# EAGLE schematic LAMPS - Copy (EAGLE 6.3)
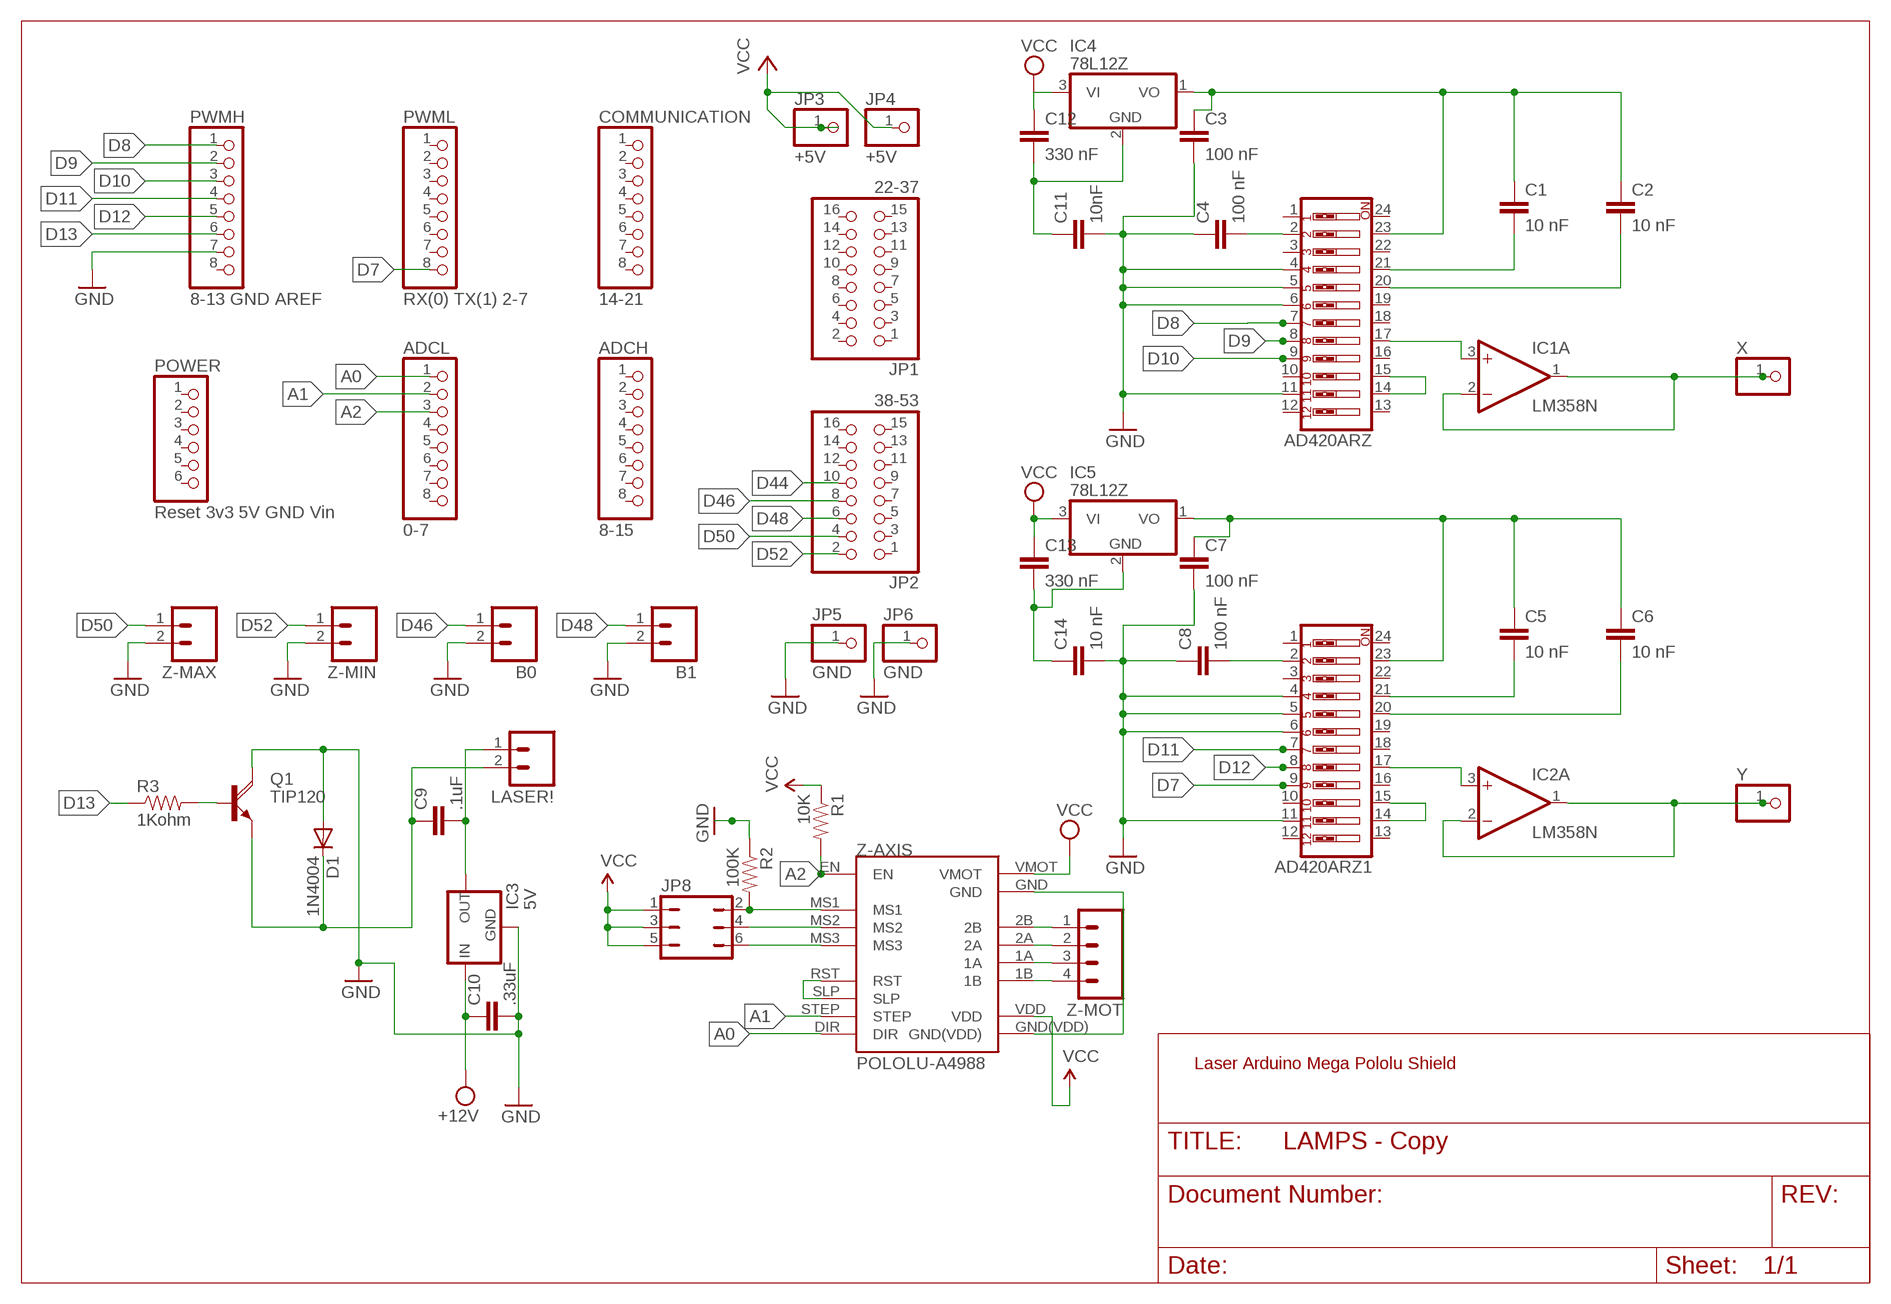
[diagram p0: schematic, sheet 1]

## Parts
AD420ARZ  SW_DIP-12  [EDG-12]
AD420ARZ1  SW_DIP-12  [EDG-12]
ADCH  8-15  PINHD-1X8  [1X08]
ADCL  0-7  PINHD-1X8  [1X08]
B0  M02PTH  [1X02]
B1  M02PTH  [1X02]
C1  10 nF  C2,5-3  [C2.5-3]
C2  10 nF  C2,5-3  [C2.5-3]
C3  100 nF  C2,5-3  [C2.5-3]
C4  100 nF  C2,5-3  [C2.5-3]
C5  10 nF  C2,5-3  [C2.5-3]
C6  10 nF  C2,5-3  [C2.5-3]
C7  100 nF  C2,5-3  [C2.5-3]
C8  100 nF  C2,5-3  [C2.5-3]
C9  .1uF  CAPPTH  [CAP-PTH-SMALL]
C10  .33uF  CAPPTH  [CAP-PTH-SMALL]
C11  10nF  C2,5-3  [C2.5-3]
C12  330 nF  C2,5-3  [C2.5-3]
C13  330 nF  C2,5-3  [C2.5-3]
C14  10 nF  C2,5-3  [C2.5-3]
COMMUNICATION  14-21  PINHD-1X8  [1X08]
D1  1N4004  [DO41-10]
IC1  LM358N  [DIL08]
IC2  LM358N  [DIL08]
IC3  5V  V_REG_78XXSIDE  [78XXL]
IC4  78L12Z  [TO92]
IC5  78L12Z  [TO92]
JP1  22-37  PINHD-2X8  [2X08]
JP2  38-53  PINHD-2X8  [2X08]
JP3  +5V  PINHD-1X1  [1X01]
JP4  +5V  PINHD-1X1  [1X01]
JP5  GND  PINHD-1X1  [1X01]
JP6  GND  PINHD-1X1  [1X01]
JP8  JP3Q  [JP3Q]
LASER!  M02POLAR  [MOLEX-1X2]
POWER  Reset 3v3 5V GND Vin  PINHD-1X6  [1X06]
PWMH  8-13 GND AREF  PINHD-1X8  [1X08]
PWML  RX(0) TX(1) 2-7  PINHD-1X8  [1X08]
Q1  TIP120  [TO220AH]
R1  10K  RESISTORAXIAL-0.3  [AXIAL-0.3]
R2  100K  RESISTORAXIAL-0.3  [AXIAL-0.3]
R3  1Kohm  RESISTORAXIAL-0.3  [AXIAL-0.3]
X  PINHD-1X1  [1X01]
Y  PINHD-1X1  [1X01]
Z-AXIS  POLOLU-A4988  [DIL_A4988]
Z-MAX  M02PTH  [1X02]
Z-MIN  M02PTH  [1X02]
Z-MOT  M04POLAR  [MOLEX-1X4]

## Nets
A0: ADCL.1 Z-AXIS.DIR
A1: ADCL.2 Z-AXIS.STEP
A2: ADCL.3 R1.P$2 Z-AXIS.EN
D7: AD420ARZ1.9 PWML.8
D8: AD420ARZ.7 PWMH.1
D9: AD420ARZ.8 PWMH.2
D10: AD420ARZ.9 PWMH.3
D11: AD420ARZ1.7 PWMH.4
D12: AD420ARZ1.8 PWMH.5
D13: PWMH.6 R3.P$1
D44: JP2.10 Q1.B R3.P$2
D46: B0.1 JP2.8
D48: B1.1 JP2.6
D50: JP2.4 Z-MAX.1
D52: JP2.2 Z-MIN.1
GND: AD420ARZ1.4 AD420ARZ1.5 AD420ARZ1.6 AD420ARZ1.11 AD420ARZ.4 AD420ARZ.5 AD420ARZ.6 AD420ARZ.11 B0.2 B1.2 C3.2 C4.1 C7.2 C8.1 C10.2 C11.1 C11.2 C12.2 C14.2 D1.A IC3.GND IC4.2(GND) JP5.1 JP6.1 PWMH.7 Q1.C R2.P$1 Z-MAX.2 Z-MIN.2
N$1: AD420ARZ1.21 C5.2
N$2: AD420ARZ1.20 C6.2
N$3: AD420ARZ.21 C1.2
N$4: AD420ARZ.20 C2.2
N$5: AD420ARZ.17 IC1.3(A:+IN)
N$6: AD420ARZ.14 AD420ARZ.15
N$7: IC1.1(A:OUT) IC1.2(A:-IN) X.1
N$8: AD420ARZ1.17 IC2.3(A:+IN)
N$9: AD420ARZ1.14 AD420ARZ1.15
N$10: IC2.1(A:OUT) IC2.2(A:-IN) Y.1
N$11: Z-AXIS.RST Z-AXIS.SLP
N$12: C9.2 IC3.OUT LASER!.1
N$13: C9.1 D1.C LASER!.2 Q1.E
N$14: Z-AXIS.GND Z-AXIS.GND(VDD)
N$15: JP8.2 R2.P$2 Z-AXIS.MS1
N$16: JP8.4 Z-AXIS.MS2
N$17: JP8.6 Z-AXIS.MS3
N$18: AD420ARZ.23 C1.1 C2.1 C3.1 IC4.1(VO)
N$19: AD420ARZ.2 C4.2
N$20: Z-AXIS.2B Z-MOT.1
N$21: Z-AXIS.2A Z-MOT.2
N$22: Z-AXIS.1A Z-MOT.3
N$23: Z-AXIS.1B Z-MOT.4
N$24: AD420ARZ1.2 C8.2
N$25: AD420ARZ1.23 C5.1 C6.1 C7.1 IC5.1(VO)
N$26: C13.2 C14.1 IC5.2(GND)
VCC: C10.1 C12.1 C13.1 IC3.IN IC4.3(VI) IC5.3(VI) JP3.1 JP4.1 JP8.1 JP8.3 JP8.5 R1.P$1 Z-AXIS.VDD Z-AXIS.VMOT ; supply symbol labelled +12V
Unconnected: AD420ARZ1.1 AD420ARZ1.3 AD420ARZ1.10 AD420ARZ1.12 AD420ARZ1.13 AD420ARZ1.16 AD420ARZ1.18 AD420ARZ1.19 AD420ARZ1.22 AD420ARZ1.24 AD420ARZ.1 AD420ARZ.3 AD420ARZ.10 AD420ARZ.12 AD420ARZ.13 AD420ARZ.16 AD420ARZ.18 AD420ARZ.19 AD420ARZ.22 AD420ARZ.24 ADCH.1 ADCH.2 ADCH.3 ADCH.4 ADCH.5 ADCH.6 ADCH.7 ADCH.8 ADCL.4 ADCL.5 ADCL.6 ADCL.7 ADCL.8 COMMUNICATION.1 COMMUNICATION.2 COMMUNICATION.3 COMMUNICATION.4 COMMUNICATION.5 COMMUNICATION.6 COMMUNICATION.7 COMMUNICATION.8 IC1.5(B:+IN) IC1.6(B:-IN) IC1.7(B:OUT) IC2.5(B:+IN) IC2.6(B:-IN) IC2.7(B:OUT) JP1.1 JP1.2 JP1.3 JP1.4 JP1.5 JP1.6 JP1.7 JP1.8 JP1.9 JP1.10 JP1.11 JP1.12 JP1.13 JP1.14 JP1.15 JP1.16 JP2.1 JP2.3 JP2.5 JP2.7 JP2.9 JP2.11 JP2.12 JP2.13 JP2.14 JP2.15 JP2.16 POWER.1 POWER.2 POWER.3 POWER.4 POWER.5 POWER.6 PWMH.8 PWML.1 PWML.2 PWML.3 PWML.4 PWML.5 PWML.6 PWML.7

## Notes on the sheet
- Laser Arduino Mega Pololu Shield

## Power pins joined to a net without a drawn wire
V+: IC1.8(P:V+) IC2.8(P:V+)
V-: IC1.4(P:V-) IC2.4(P:V-)

## Library data of the parts
AD420ARZ AD420ARZ1 = special:SW_DIP-12: DIP SWITCH
ADCH ADCL COMMUNICATION PWMH PWML = pinhead:PINHD-1X8: PIN HEADER
B0 B1 LASER! Z-MAX Z-MIN = SparkFun:M02: Header 2 Standard 2-pin 0.1" header. Use with straight break away headers (SKU : PRT-00116), right angle break away headers (PRT-00553), swiss pins (PRT-00743), machine pins (PRT-00117), and female headers (PRT-00115). Molex polarized connector foot print use with SKU : PRT-08233 with associated crimp pins and housings.
C1-C8 C11-C14 = capacitor-wima:C: CAPACITOR naming: grid - package width
C9 C10 = SparkFun:CAP: Capacitor Standard 0603 ceramic capacitor, and 0.1" leaded capacitor.
D1 = diode:1N4004: DIODE general purpose rectifier, 1 A
IC1 IC2 = linear:LM358: OP AMP also LM158; LM258; LM2904 Source: http://cache.national.com/ds/LM/LM158.pdf
IC3 = SparkFun:V_REG_78XX: Voltage Regulator Standard 7805 5V regulator. IGO (Input Ground Output). Spark Fun Electronics SKU : COM-00107
IC4 IC5 = linear:78*: Positive VOLTAGE REGULATOR Source: http://cache.national.com/ds/LM/LM78L05.pdf http://www.fairchildsemi.com/ds/LM/LM7805.pdf
JP1 JP2 = pinhead:PINHD-2X8: PIN HEADER
JP3-JP6 X Y = pinhead:PINHD-1X1: PIN HEADER
JP8 = jumper:JP3Q: JUMPER
POWER = pinhead:PINHD-1X6: PIN HEADER
Q1 = transistor-power:TIP120: NPN DARLINGTON TRANSISTOR
R1-R3 = SparkFun:RESISTOR: Resistor Basic schematic elements and footprints for 0603, 1206, and PTH resistors.
Z-AXIS = Pololu-A4988:POLOLU-A4988
Z-MOT = SparkFun:M04: Header 4 Standard 4-pin 0.1" header. Use with straight break away headers (SKU : PRT-00116), right angle break away headers (PRT-00553), swiss pins (PRT-00743), machine pins (PRT-00117), and female headers (PRT-00115). Molex polarized connector foot print use with SKU : PRT-08231 with associated crimp pins and housings. 1MM SMD Version SKU: PRT-10208

## Net classes
0 default: width 0.203 mm, drill 0.406 mm, clearance 0.203 mm
1 power: width 0.61 mm, drill 0.711 mm, clearance 0.203 mm
2 gnd: width 0.305 mm, drill 0.711 mm, clearance 0.203 mm
3 usbvcc: width 0.508 mm, drill 0.711 mm, clearance 0.203 mm